# Altium schematic sheet RJ45 Connector and ESD Diodes.SchDoc: RK3399 COB Design V1.0
size A4; Author: AVIRAL MISHRA; DocumentNumber: 18; SheetNumber: 18; SheetTotal: 27; PROJECT CODE: A_V1.0
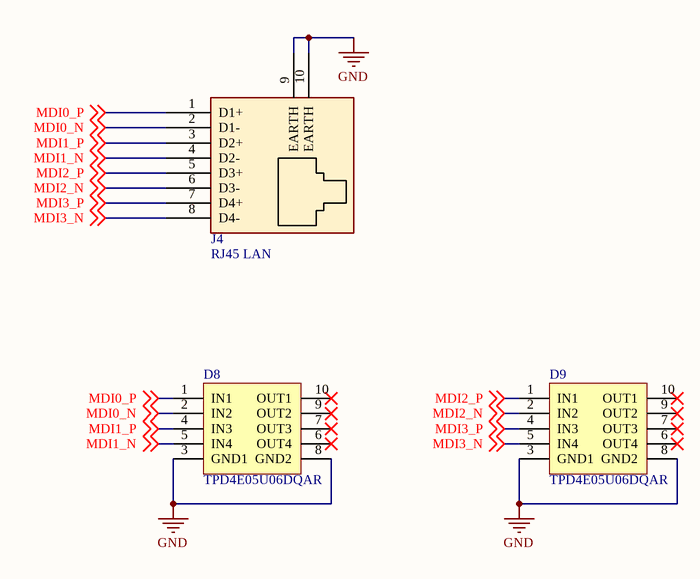
[diagram p0: RJ45 Connector and ESD Diodes.SchDoc]

## Parts
D8  TPD4E05U06DQAR  [DIO_USON-10_SMD]
D9  TPD4E05U06DQAR  [DIO_USON-10_SMD]
J4  RJ45 LAN  [CON10_P106_RJ45_TH_ST]

## Nets
GND: D8.3(GND1) D8.8(GND2) D9.3(GND1) D9.8(GND2) J4.9(EARTH) J4.10(EARTH)
MDI0_N: D8.2(IN2) J4.2(D1-) ; off-sheet MDI0_N
MDI0_P: D8.1(IN1) J4.1(D1+) ; off-sheet MDI0_P
MDI1_N: D8.5(IN4) J4.4(D2-) ; off-sheet MDI1_N
MDI1_P: D8.4(IN3) J4.3(D2+) ; off-sheet MDI1_P
MDI2_N: D9.2(IN2) J4.6(D3-) ; off-sheet MDI2_N
MDI2_P: D9.1(IN1) J4.5(D3+) ; off-sheet MDI2_P
MDI3_N: D9.5(IN4) J4.8(D4-) ; off-sheet MDI3_N
MDI3_P: D9.4(IN3) J4.7(D4+) ; off-sheet MDI3_P

Not connected (* = marked no-connect by the designer): D8 6(OUT4)* 7(OUT3)* 9(OUT2)* 10(OUT1)*; D9 6(OUT4)* 7(OUT3)* 9(OUT2)* 10(OUT1)*

## Notes on the sheet
- TITLE:
- DOCUMENT NAME:
- SCALE 1:1
- This document is copyright of EsteemPCB and shall not be revealed, produced, copied, in whole or in part, nor
- PROJECT CODE:
- TEMPLATE:
- A4
- AUTHOR:
- Sheet
- of
- used for any purpose other than submitted.

## Library data of the parts
D8 D9 = DIO-T_5.5V-14V-2.5A-10-USON: 14V Clamp 2.5A (8/20µs) Ipp Tvs Diode Surface Mount 10-USON (2.5x1) /; Manufacturer: Texas Instruments; Manufacturer Part Number: TPD4E05U06DQAR; Case/Package: 10-USON; Supplier-1: Digikey
J4 = CON-SKT-RJ_8C8P-RA-TH: 8 Pins, 2 Row 2.54mm Pitch, right angle Connector, male; Manufacturer: Assmann; Manufacturer Part Number: A-2004-2-4-LPS-N-R; Case/Package: TH-CON; Supplier-1: SP ROAD